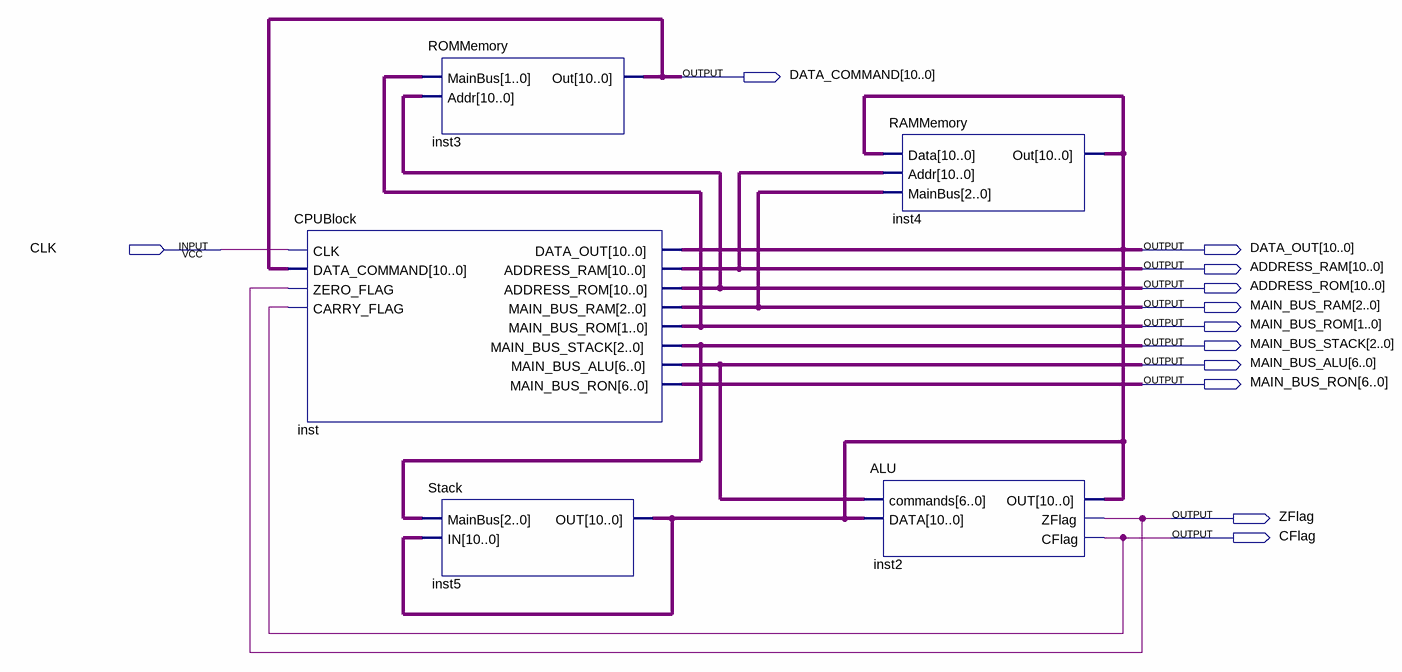
[diagram p0: schematic sheet]
// Quartus schematic main.bdf as structural Verilog: 5 symbols, 12 pins
module main (
  input  CLK,
  output [10:0] DATA_COMMAND,
  output [10:0] DATA_OUT,
  output [10:0] ADDRESS_RAM,
  output [10:0] ADDRESS_ROM,
  output [2:0] MAIN_BUS_RAM,
  output [1:0] MAIN_BUS_ROM,
  output [2:0] MAIN_BUS_STACK,
  output [6:0] MAIN_BUS_ALU,
  output [6:0] MAIN_BUS_RON,
  output ZFlag,
  output CFlag
);

  CPUBlock inst (
    .CLK(CLK), .DATA_COMMAND(DATA_COMMAND), .ZERO_FLAG(ZFlag), .CARRY_FLAG(CFlag), .DATA_OUT(DATA_OUT),
    .ADDRESS_RAM(ADDRESS_RAM), .ADDRESS_ROM(ADDRESS_ROM), .MAIN_BUS_RAM(MAIN_BUS_RAM),
    .MAIN_BUS_ROM(MAIN_BUS_ROM), .MAIN_BUS_STACK(MAIN_BUS_STACK), .MAIN_BUS_ALU(MAIN_BUS_ALU),
    .MAIN_BUS_RON(MAIN_BUS_RON));
  ROMMemory inst3 (.MainBus(MAIN_BUS_ROM), .Addr(ADDRESS_ROM), .Out(DATA_COMMAND));
  Stack inst5 (.MainBus(MAIN_BUS_STACK), .IN(DATA_OUT), .OUT(DATA_OUT));
  ALU inst2 (.commands(MAIN_BUS_ALU), .DATA(DATA_OUT), .OUT(DATA_OUT), .ZFlag(ZFlag), .CFlag(CFlag));
  RAMMemory inst4 (.Data(DATA_OUT), .Addr(ADDRESS_RAM), .MainBus(MAIN_BUS_RAM), .Out(DATA_OUT));
endmodule
